# EasyEDA schematic 00003_2020-06-15_05-30-21.json
TITLE: Sheet_1; REV: 1.0; Date: 2020-05-20; Sheet: 1/1; Company: Your Company
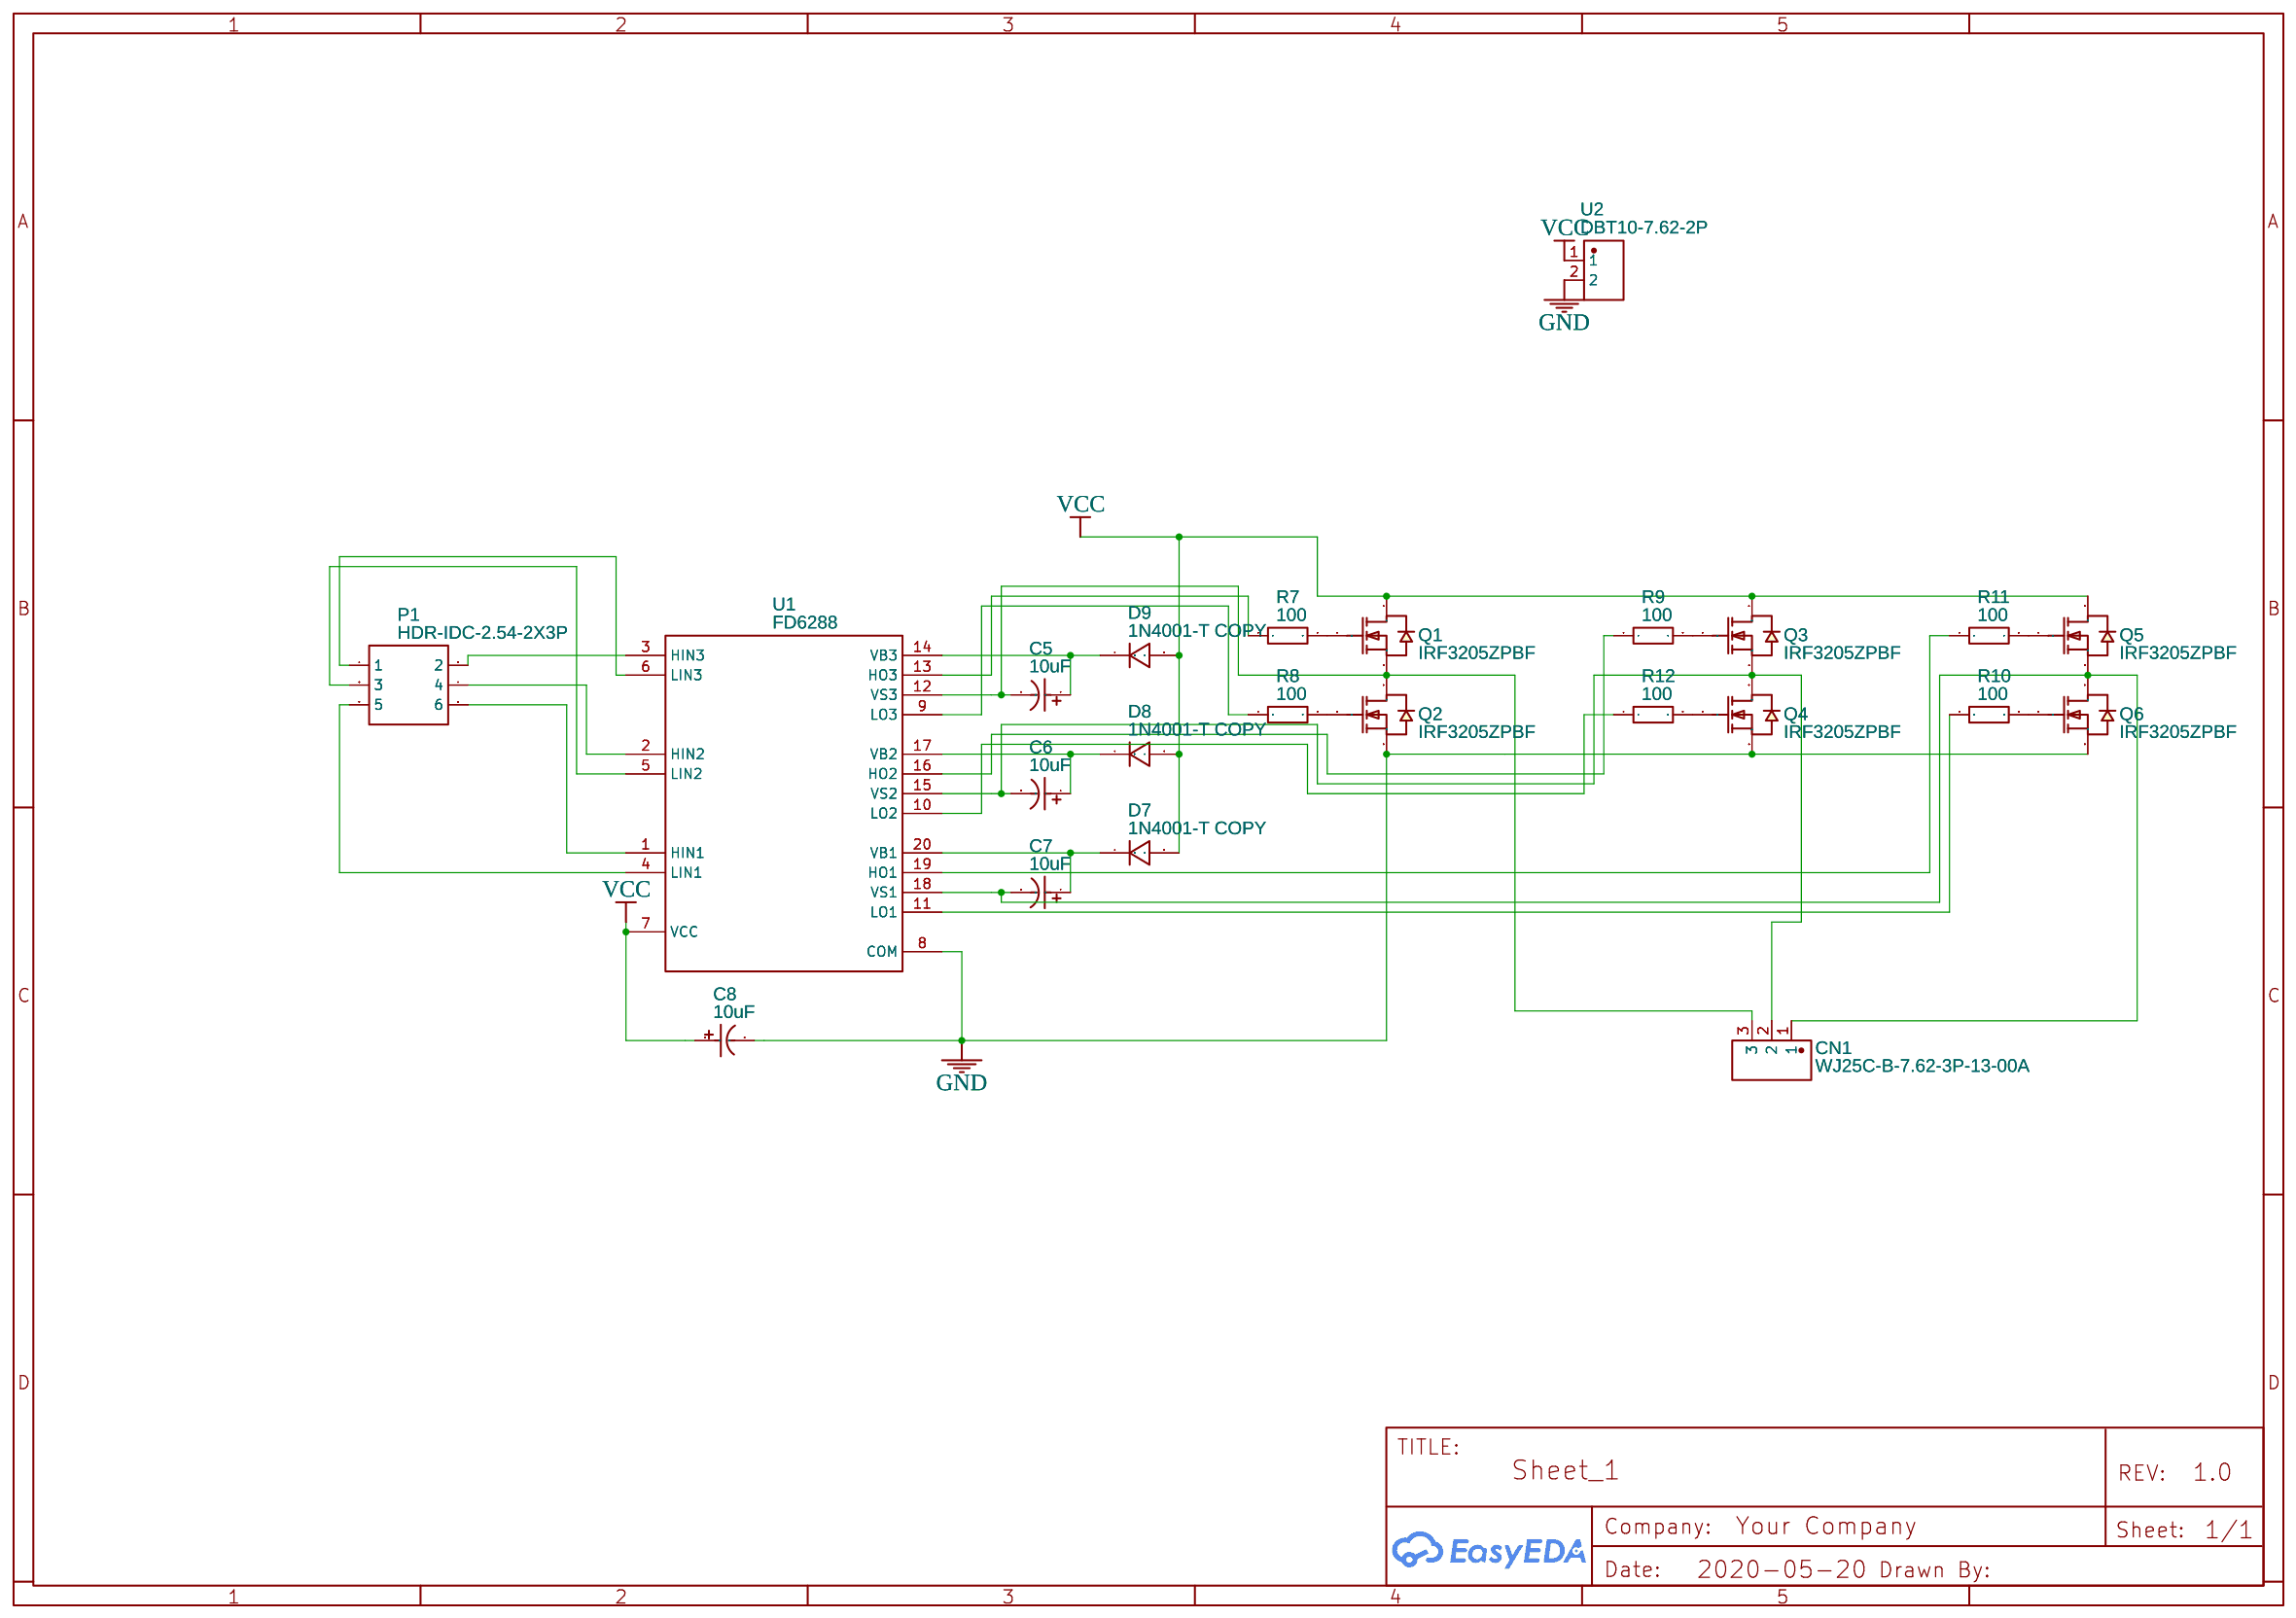
[diagram p0: schematic sheet]

## Parts
C5  10uF  [CAP-TH_BD5.0-P2.00-D0.8-FD]
C6  10uF  [CAP-TH_BD5.0-P2.00-D0.8-FD]
C7  10uF  [CAP-TH_BD5.0-P2.00-D0.8-FD]
C8  10uF  [CAP-TH_BD5.0-P2.00-D0.8-FD]
CN1  WJ25C-B-7.62-3P-13-00A  [CONN-TH_3P-P7.62_WJ25C-B-7.62-3P]
D7  1N4001-T COPY  [IN4001]
D8  1N4001-T COPY  [IN4001]
D9  1N4001-T COPY  [IN4001]
P1  HDR-IDC-2.54-2X3P  [IDC-TH_6P-P2.54_C11214]
Q1  IRF3205ZPBF  [TO-220-3_L10.0-W4.5-P2.54-T]
Q2  IRF3205ZPBF  [TO-220-3_L10.0-W4.5-P2.54-T]
Q3  IRF3205ZPBF  [TO-220-3_L10.0-W4.5-P2.54-T]
Q4  IRF3205ZPBF  [TO-220-3_L10.0-W4.5-P2.54-T]
Q5  IRF3205ZPBF  [TO-220-3_L10.0-W4.5-P2.54-T]
Q6  IRF3205ZPBF  [TO-220-3_L10.0-W4.5-P2.54-T]
R7  100  [RES-TH_BD2.3-L6.5-P10.50-D0.5]
R8  100  [RES-TH_BD2.3-L6.5-P10.50-D0.5]
R9  100  [RES-TH_BD2.3-L6.5-P10.50-D0.5]
R10  100  [RES-TH_BD2.3-L6.5-P10.50-D0.5]
R11  100  [RES-TH_BD2.3-L6.5-P10.50-D0.5]
R12  100  [RES-TH_BD2.3-L6.5-P10.50-D0.5]
U1  FD6288  [TSSOP-20_L6.5-W4.4-P0.65-LS6.4-BL]
U2  DBT10-7.62-2P  [CONN-TH_2P-P7.62_DBT10-7.62-2P]

## Library data of the parts
C5-C8 = 10uF 25V 5*11: Supplier: LCSC; Manufacturer: ValuePro; Supplier Part: C43347
CN1 = WJ25C-B-7.62-3P-13-00A: Supplier: LCSC; Manufacturer: ReliaPro; image: //image.lceda.cn/szlcsc/C61583.jpg; Supplier Part: C61583
D7-D9 = 1N4001-T COPY: Supplier: LCSC; Supplier Part: C99656; Manufacturer: Diodes Incorporated; Manufacturer Part: 1N4001-T; Contributor: LCSC
P1 = HDR-IDC-2.54-2X3P: Supplier: LCSC; Manufacturer: BOOMELE; Manufacturer Part: 2X3 2.54mm IDC Box; image: //image.lceda.cn/szlcsc/C11214.jpg; Supplier Part: C11214
Q1-Q6 = IRF3205ZPBF: Supplier: LCSC; Manufacturer: Infineon; image: //image.lceda.cn/szlcsc/C2612.jpg; Supplier Part: C2612
R7-R12 = CF1/4W-100Ω±5% T52: Supplier: LCSC; Supplier Part: C120031; Manufacturer: Chian Chia Elec; Contributor: LCSC
U1 = FD6288: Supplier: LCSC; Manufacturer: Fortior Technol; Supplier Part: C97683; LCSC Assembly: Yes; SMT Type: Extend
U2 = DBT10-7.62-2P: Supplier: LCSC; Supplier Part: C395930; Manufacturer: DIBO; Contributor: LCSC

## Nets
GND: C8.2 Q2.3(S) Q4.3(S) Q6.3(S) U1.8(COM) U2.2
VCC: C8.1 D7.2(A) D8.2(A) D9.2(A) Q1.2(D) Q3.2(D) Q5.2(D) U1.7(VCC) U2.1
Net-(C5-1): C5.1 D9.1(C) U1.14(VB3)
Net-(C5-2): C5.2 CN1.3 Q1.3(S) Q2.2(D) U1.12(VS3)
Net-(C6-1): C6.1 D8.1(C) U1.17(VB2)
Net-(C6-2): C6.2 CN1.2 Q3.3(S) Q4.2(D) U1.15(VS2)
Net-(C7-1): C7.1 D7.1(C) U1.20(VB1)
Net-(C7-2): C7.2 CN1.1 Q5.3(S) Q6.2(D) U1.18(VS1)
Net-(P1-1): P1.1 U1.6(LIN3)
Net-(P1-2): P1.2 U1.3(HIN3)
Net-(P1-3): P1.3 U1.5(LIN2)
Net-(P1-4): P1.4 U1.2(HIN2)
Net-(P1-5): P1.5 U1.4(LIN1)
Net-(P1-6): P1.6 U1.1(HIN1)
Net-(Q1-1): Q1.1(G) R7.2
Net-(Q2-1): Q2.1(G) R8.2
Net-(Q3-1): Q3.1(G) R9.2
Net-(Q4-1): Q4.1(G) R12.2
Net-(Q5-1): Q5.1(G) R11.2
Net-(Q6-1): Q6.1(G) R10.2
Net-(R7-1): R7.1 U1.13(HO3)
Net-(R8-1): R8.1 U1.9(LO3)
Net-(R9-1): R9.1 U1.16(HO2)
Net-(R10-1): R10.1 U1.11(LO1)
Net-(R11-1): R11.1 U1.19(HO1)
Net-(R12-1): R12.1 U1.10(LO2)
